# Altium schematic sheet com.SchDoc
size A4
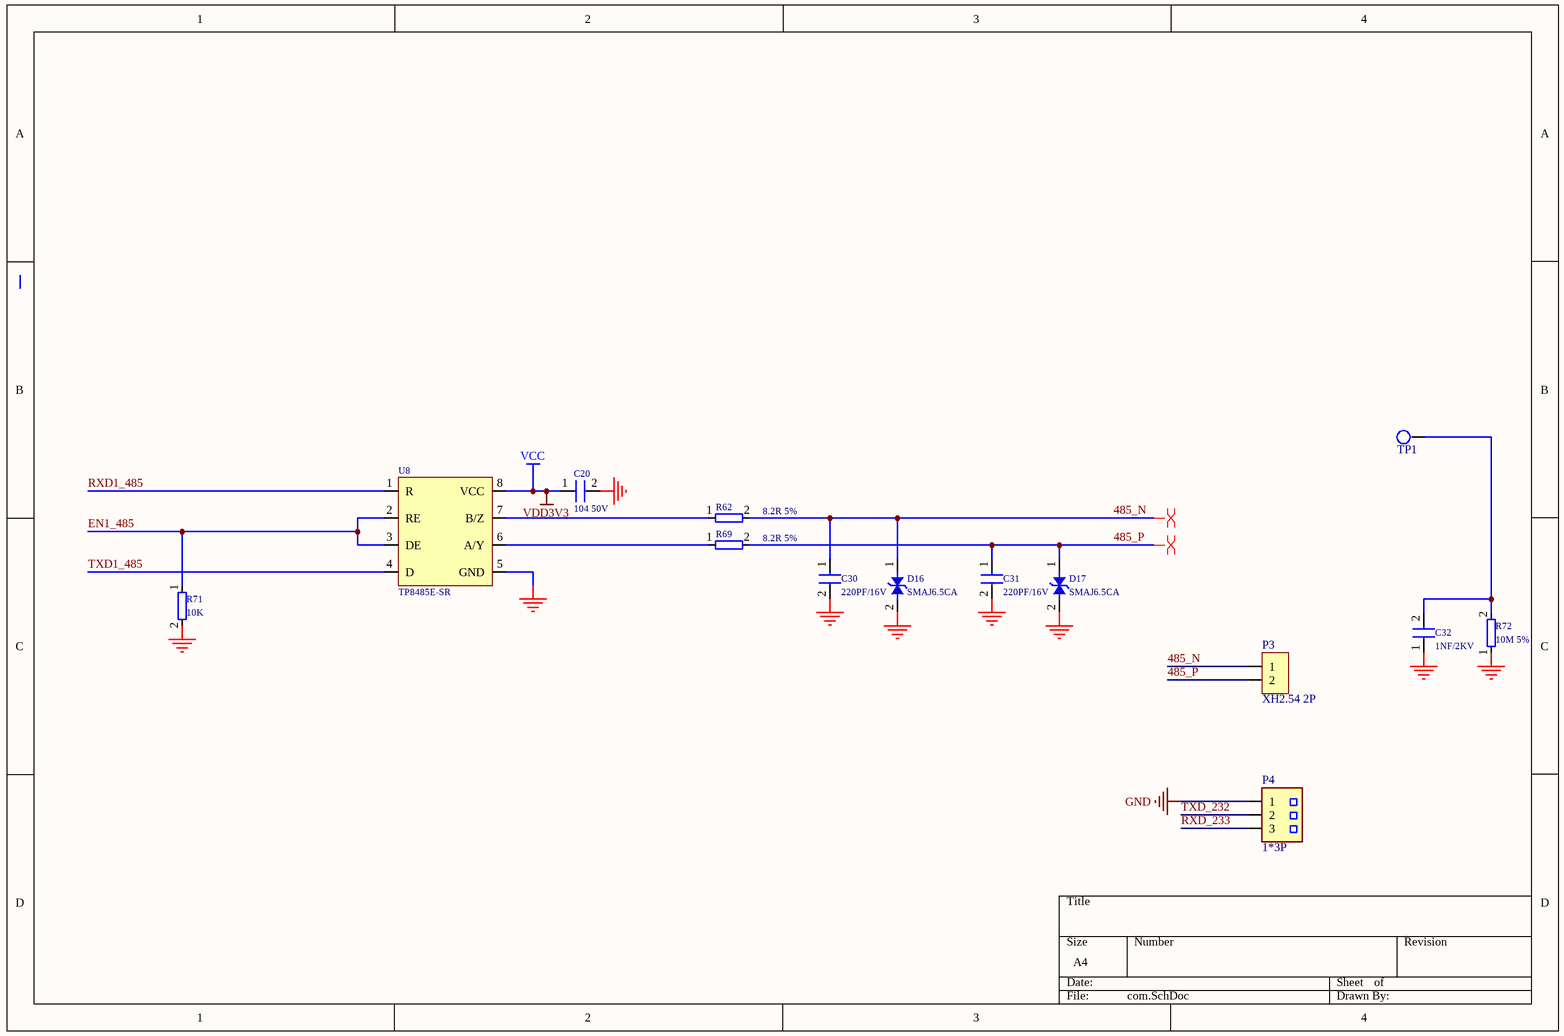
[diagram p0: com.SchDoc]

## Parts
C20  104 50V  [0603C]
C30  220PF/16V  [0603C]
C31  220PF/16V  [0603C]
C32  1NF/2KV  [1206C]
D16  SMAJ6.5CA  [SMA]
D17  SMAJ6.5CA  [SMA]
P3  XH2.54 2P  [SIP-2A]
P4  1*3P  [3X2.54MMZ2]
R62  8.2R 5%  [0603R]
R69  8.2R 5%  [0603R]
R71  10K  [0603R]
R72  10M 5%  [1206r]
TP1  TPS  [tpd]  (value not drawn)
U8  TP8485E-SR  [SO-8]

## Nets
GND: C20.2 C30.2 C31.2 C32.1 D16.2 D17.2 P4.1 R71.2 R72.1 U8.5(GND)
VCC: C20.1 U8.8(VCC)  [also labelled VDD3V3]
485_N: C30.1 D16.1 P3.1 R62.2
485_P: C31.1 D17.1 P3.2 R69.2
EN1_485: R71.1 U8.2(RE) U8.3(DE)
RXD1_485: U8.1(R)
RXD_233: P4.3
TXD1_485: U8.4(D)
TXD_232: P4.2
NetC32_2: C32.2 R72.2 TP1.1
NetR62_1: R62.1 U8.7(B/Z)
NetR69_1: R69.1 U8.6(A/Y)

## Layout directives
differential pair: 485_N, 485_P

## Library data of the parts
C20 C30-C32 = CAP
D16 D17 = D_ESD
P3 = SIP-2: XH2.54 2P 直插
P4 = HDR1*3
R62 R69 R71 R72 = RES